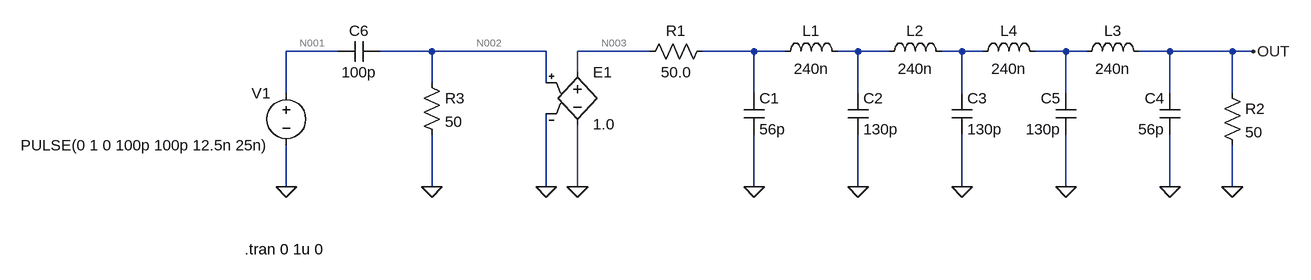
[diagram p0: schematic 45MHz_LPF.asc]
45MHz_LPF.asc, the LTspice schematic file:
Version 4
SHEET 1 1508 680
WIRE 32 0 -48 0
WIRE 176 0 96 0
WIRE 352 0 176 0
WIRE 512 0 400 0
WIRE 672 0 592 0
WIRE 720 0 672 0
WIRE 832 0 800 0
WIRE 880 0 832 0
WIRE 992 0 960 0
WIRE 1024 0 992 0
WIRE 1152 0 1104 0
WIRE 1184 0 1152 0
WIRE 1312 0 1264 0
WIRE 1408 0 1312 0
WIRE 1440 0 1408 0
WIRE 400 32 400 0
WIRE 176 48 176 0
WIRE 352 48 352 0
WIRE -48 64 -48 0
WIRE 672 64 672 0
WIRE 832 64 832 0
WIRE 992 64 992 0
WIRE 1152 64 1152 0
WIRE 1312 64 1312 0
WIRE 1408 64 1408 0
WIRE -48 208 -48 144
WIRE 176 208 176 128
WIRE 352 208 352 96
WIRE 400 208 400 112
WIRE 672 208 672 128
WIRE 832 208 832 128
WIRE 992 208 992 128
WIRE 1152 208 1152 128
WIRE 1312 208 1312 128
WIRE 1408 208 1408 144
FLAG -48 208 0
FLAG 400 208 0
FLAG 352 208 0
FLAG 672 208 0
FLAG 832 208 0
FLAG 1312 208 0
FLAG 1152 208 0
FLAG 992 208 0
FLAG 1440 0 OUT
FLAG 1408 208 0
FLAG 176 208 0
SYMBOL voltage -48 48 M0
WINDOW 123 0 0 Left 0
WINDOW 39 0 0 Left 0
SYMATTR InstName V1
SYMATTR Value PULSE(0 1 0 100p 100p 12.5n 25n)
SYMBOL res 608 -16 R90
WINDOW 0 0 56 VBottom 2
WINDOW 3 32 56 VTop 2
SYMATTR InstName R1
SYMATTR Value 50.0
SYMBOL e 400 16 R0
SYMATTR InstName E1
SYMATTR Value 1.0
SYMBOL ind 704 16 R270
WINDOW 0 32 56 VTop 2
WINDOW 3 5 56 VBottom 2
SYMATTR InstName L1
SYMATTR Value 240n
SYMBOL cap 656 64 R0
SYMATTR InstName C1
SYMATTR Value 56p
SYMBOL cap 816 64 R0
SYMATTR InstName C2
SYMATTR Value 130p
SYMBOL ind 864 16 R270
WINDOW 0 32 56 VTop 2
WINDOW 3 5 56 VBottom 2
SYMATTR InstName L2
SYMATTR Value 240n
SYMBOL cap 976 64 R0
SYMATTR InstName C3
SYMATTR Value 130p
SYMBOL ind 1280 16 M270
WINDOW 0 32 56 VTop 2
WINDOW 3 5 56 VBottom 2
SYMATTR InstName L3
SYMATTR Value 240n
SYMBOL cap 1328 64 M0
SYMATTR InstName C4
SYMATTR Value 56p
SYMBOL cap 1168 64 M0
SYMATTR InstName C5
SYMATTR Value 130p
SYMBOL ind 1120 16 M270
WINDOW 0 32 56 VTop 2
WINDOW 3 5 56 VBottom 2
SYMATTR InstName L4
SYMATTR Value 240n
SYMBOL res 1392 48 R0
SYMATTR InstName R2
SYMATTR Value 50
SYMBOL cap 96 -16 R90
WINDOW 0 0 32 VBottom 2
WINDOW 3 32 32 VTop 2
SYMATTR InstName C6
SYMATTR Value 100p
SYMBOL res 160 32 R0
SYMATTR InstName R3
SYMATTR Value 50
TEXT -112 304 Left 2 !.tran 0 1u 0

The netlist it stands for:
* 45MHz_LPF.asc
V1 N001 0 PULSE(0 1 0 100p 100p 12.5n 25n)
R1 N004 N003 50.0
E1 N003 0 N002 0 1.0
L1 N004 N005 240n
C1 N004 0 56p
C2 N005 0 130p
L2 N005 N006 240n
C3 N006 0 130p
L3 OUT N007 240n
C4 OUT 0 56p
C5 N007 0 130p
L4 N007 N006 240n
R2 OUT 0 50
C6 N002 N001 100p
R3 N002 0 50
.tran 0 1u 0
.backanno
.end

* Results of the author's LTspice run, read from the files saved beside the schematic
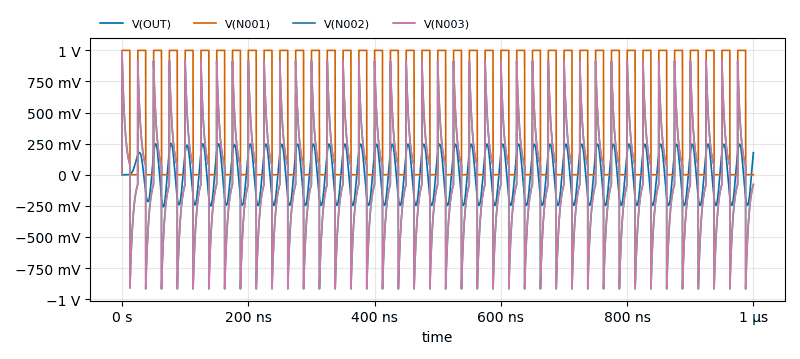
[diagram p1: Transient Analysis of 45MHz_LPF.asc, plotted from the saved traces]
* Transient Analysis, 1 run:
*   V(OUT): min -257.3 mV, max 251.3 mV, average 560.8 µV, rms 172.1 mV, last 177.6 mV
*   V(N001): min 0 V, max 1 V, average 504 mV, rms 709.1 mV, last 0 V
*   V(N002): min -916.9 mV, max 990.1 mV, average 378.7 µV, rms 413.5 mV, last -77.96 mV
*   V(N003): min -916.9 mV, max 990.1 mV, average 378.7 µV, rms 413.5 mV, last -77.96 mV